# EAGLE schematic current (EAGLE 9.6.2)
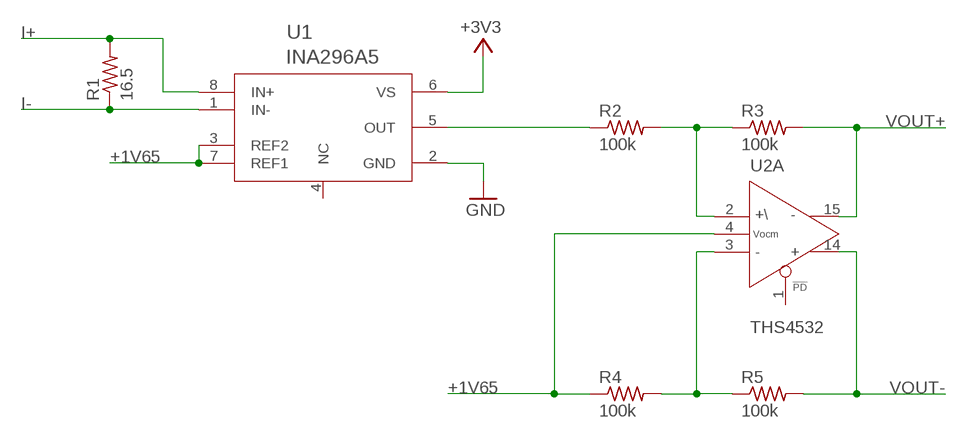
[diagram p0: schematic, sheet 1]

## Parts
R1  16.5  R-US_R0805  [R0805]
R2  100k  R-US_R0805  [R0805]
R3  100k  R-US_R0805  [R0805]
R4  100k  R-US_R0805  [R0805]
R5  100k  R-US_R0805  [R0805]
U1  INA296A5  [SOT65P280X110-8N]
U2  THS4532  [SOP65P640X120-16N]

## Nets
+1V65: R4.1 U1.3(REF2) U1.7(REF1) U2.4(A:VOCM)
+3V3: U1.6(VS)
GND: U1.2(GND)
I+: R1.2 U1.8(IN+)
I-: R1.1 U1.1(IN-)
N$1: R2.2 R3.1 U2.2(A:+IN)
N$2: R4.2 R5.1 U2.3(A:-IN)
N$3: R2.1 U1.5(OUT)
VOUT+: R3.2 U2.15(A:OUT-)
VOUT-: R5.2 U2.14(A:OUT+)
Unconnected: U1.4(NC) U2.1(A:!PD) U2.5(B:!PD) U2.6(B:+IN) U2.7(B:-IN) U2.8(B:VOCM) U2.10(B:OUT+) U2.11(B:OUT-)

## Power pins joined to a net without a drawn wire
V+: U2.9(C:V+) U2.13(C:V+)
V-: U2.12(C:V-) U2.16(C:V-)

## Library data of the parts
R1-R5 = rcl:R-US_: RESISTOR, American symbol; SPICEPREFIX: R
U1 = Soil Power Sensor:INA296*: -5-V to 110-V, bidirectional, 1.1-MHz 5-V/µs ultraprecise current sense amplifier; AUTHOR: John Madden <jmadden173@pm.me>; DATE_CREATED: 2023-04-05; DATE_MODIFIED: 2023-04-05; GAIN: 200; MFC: TI; MPN: INA296A5IDDFR; QTY: 1; REF: https://www.ti.com/product/INA296A
U2 = Soil Power Sensor:THS4532: Dual, Ultra low power 0.25mA, RRO, fully differential amplifier; AUTHOR: John Madden <jmadden173@pm.me>; DATE_CREATED: 2023-04-06; DATE_MODIFIED: 2023-04-06; MFC: TI; MPN: THS4532IPW; REF: https://www.ti.com/product/THS4532